# EAGLE design Rs485 current sense V1.1 (EAGLE 7.2.0)
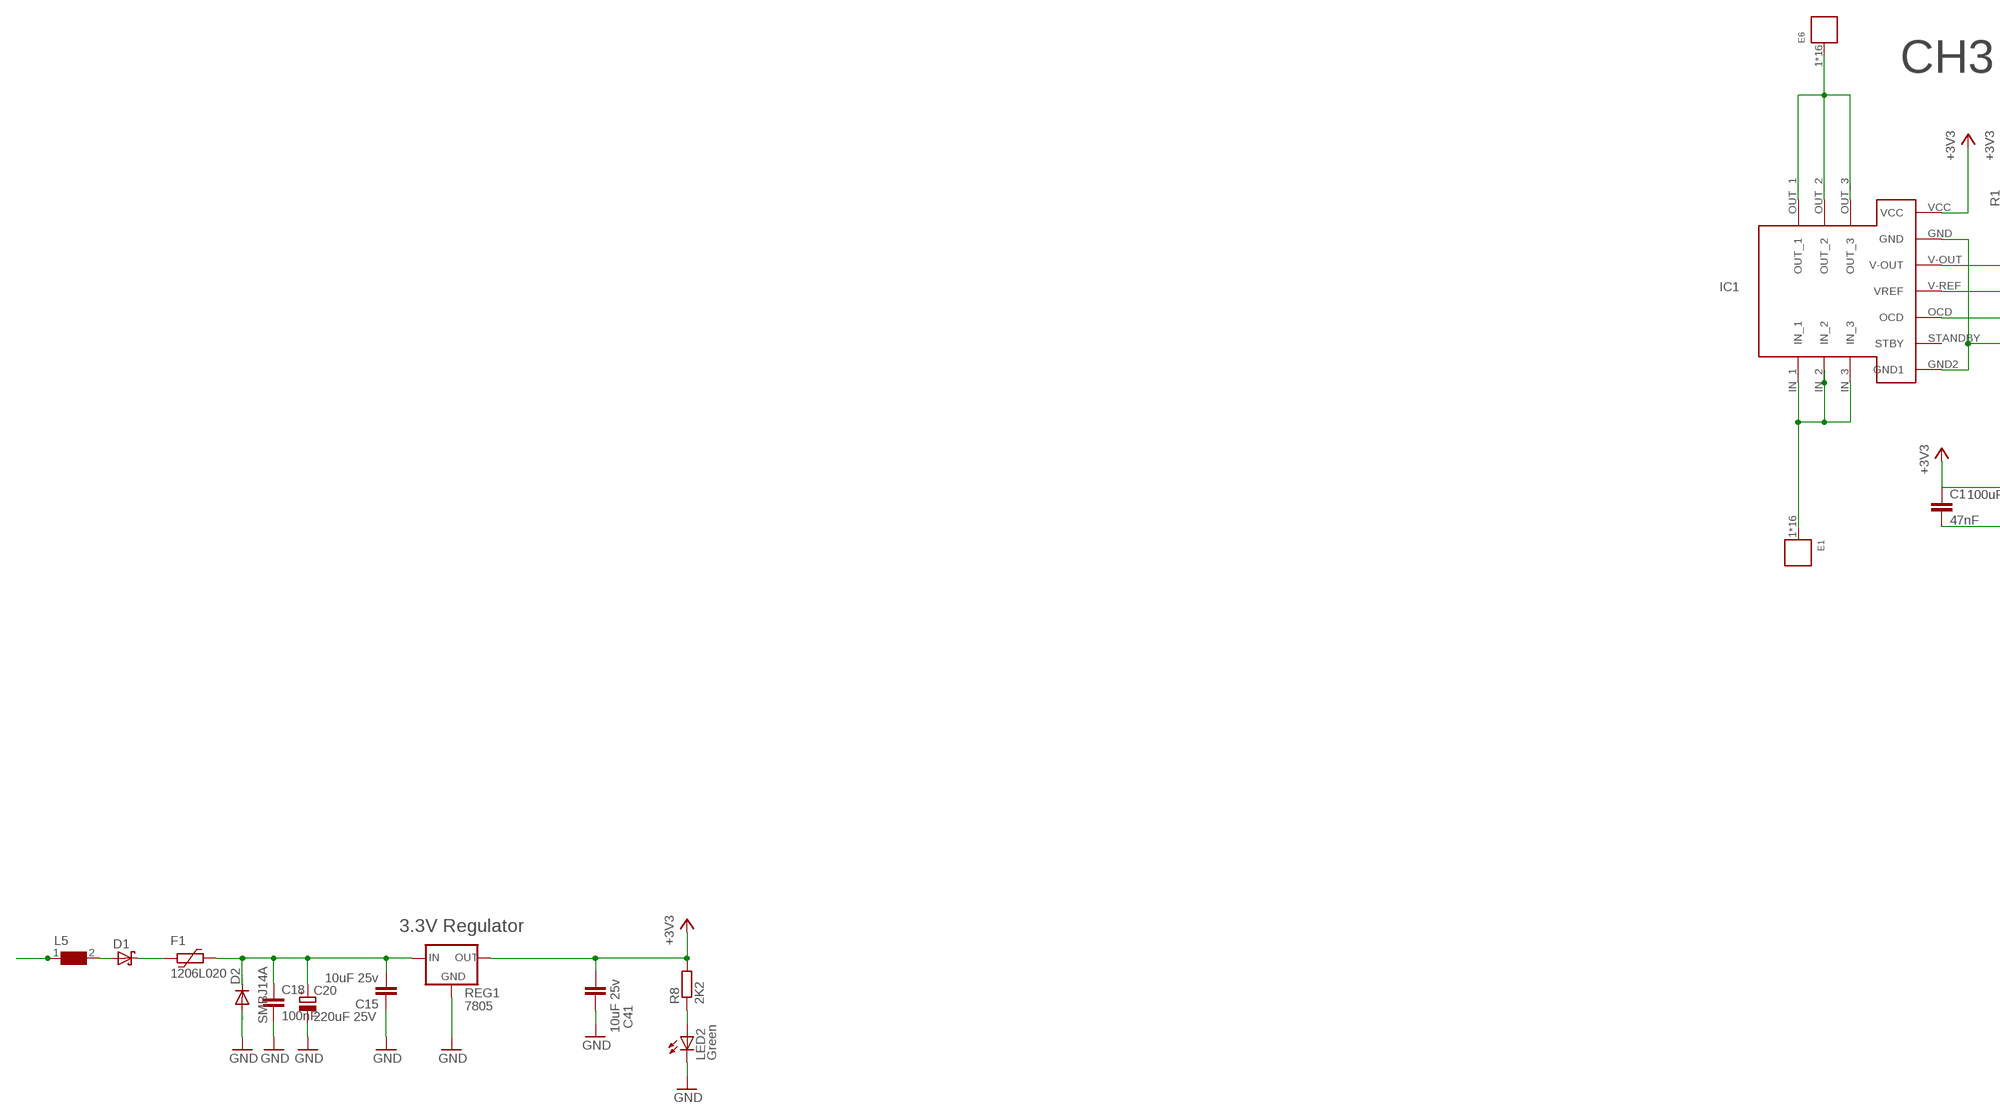
[diagram p0: schematic, sheet 1, part 1 of 3]
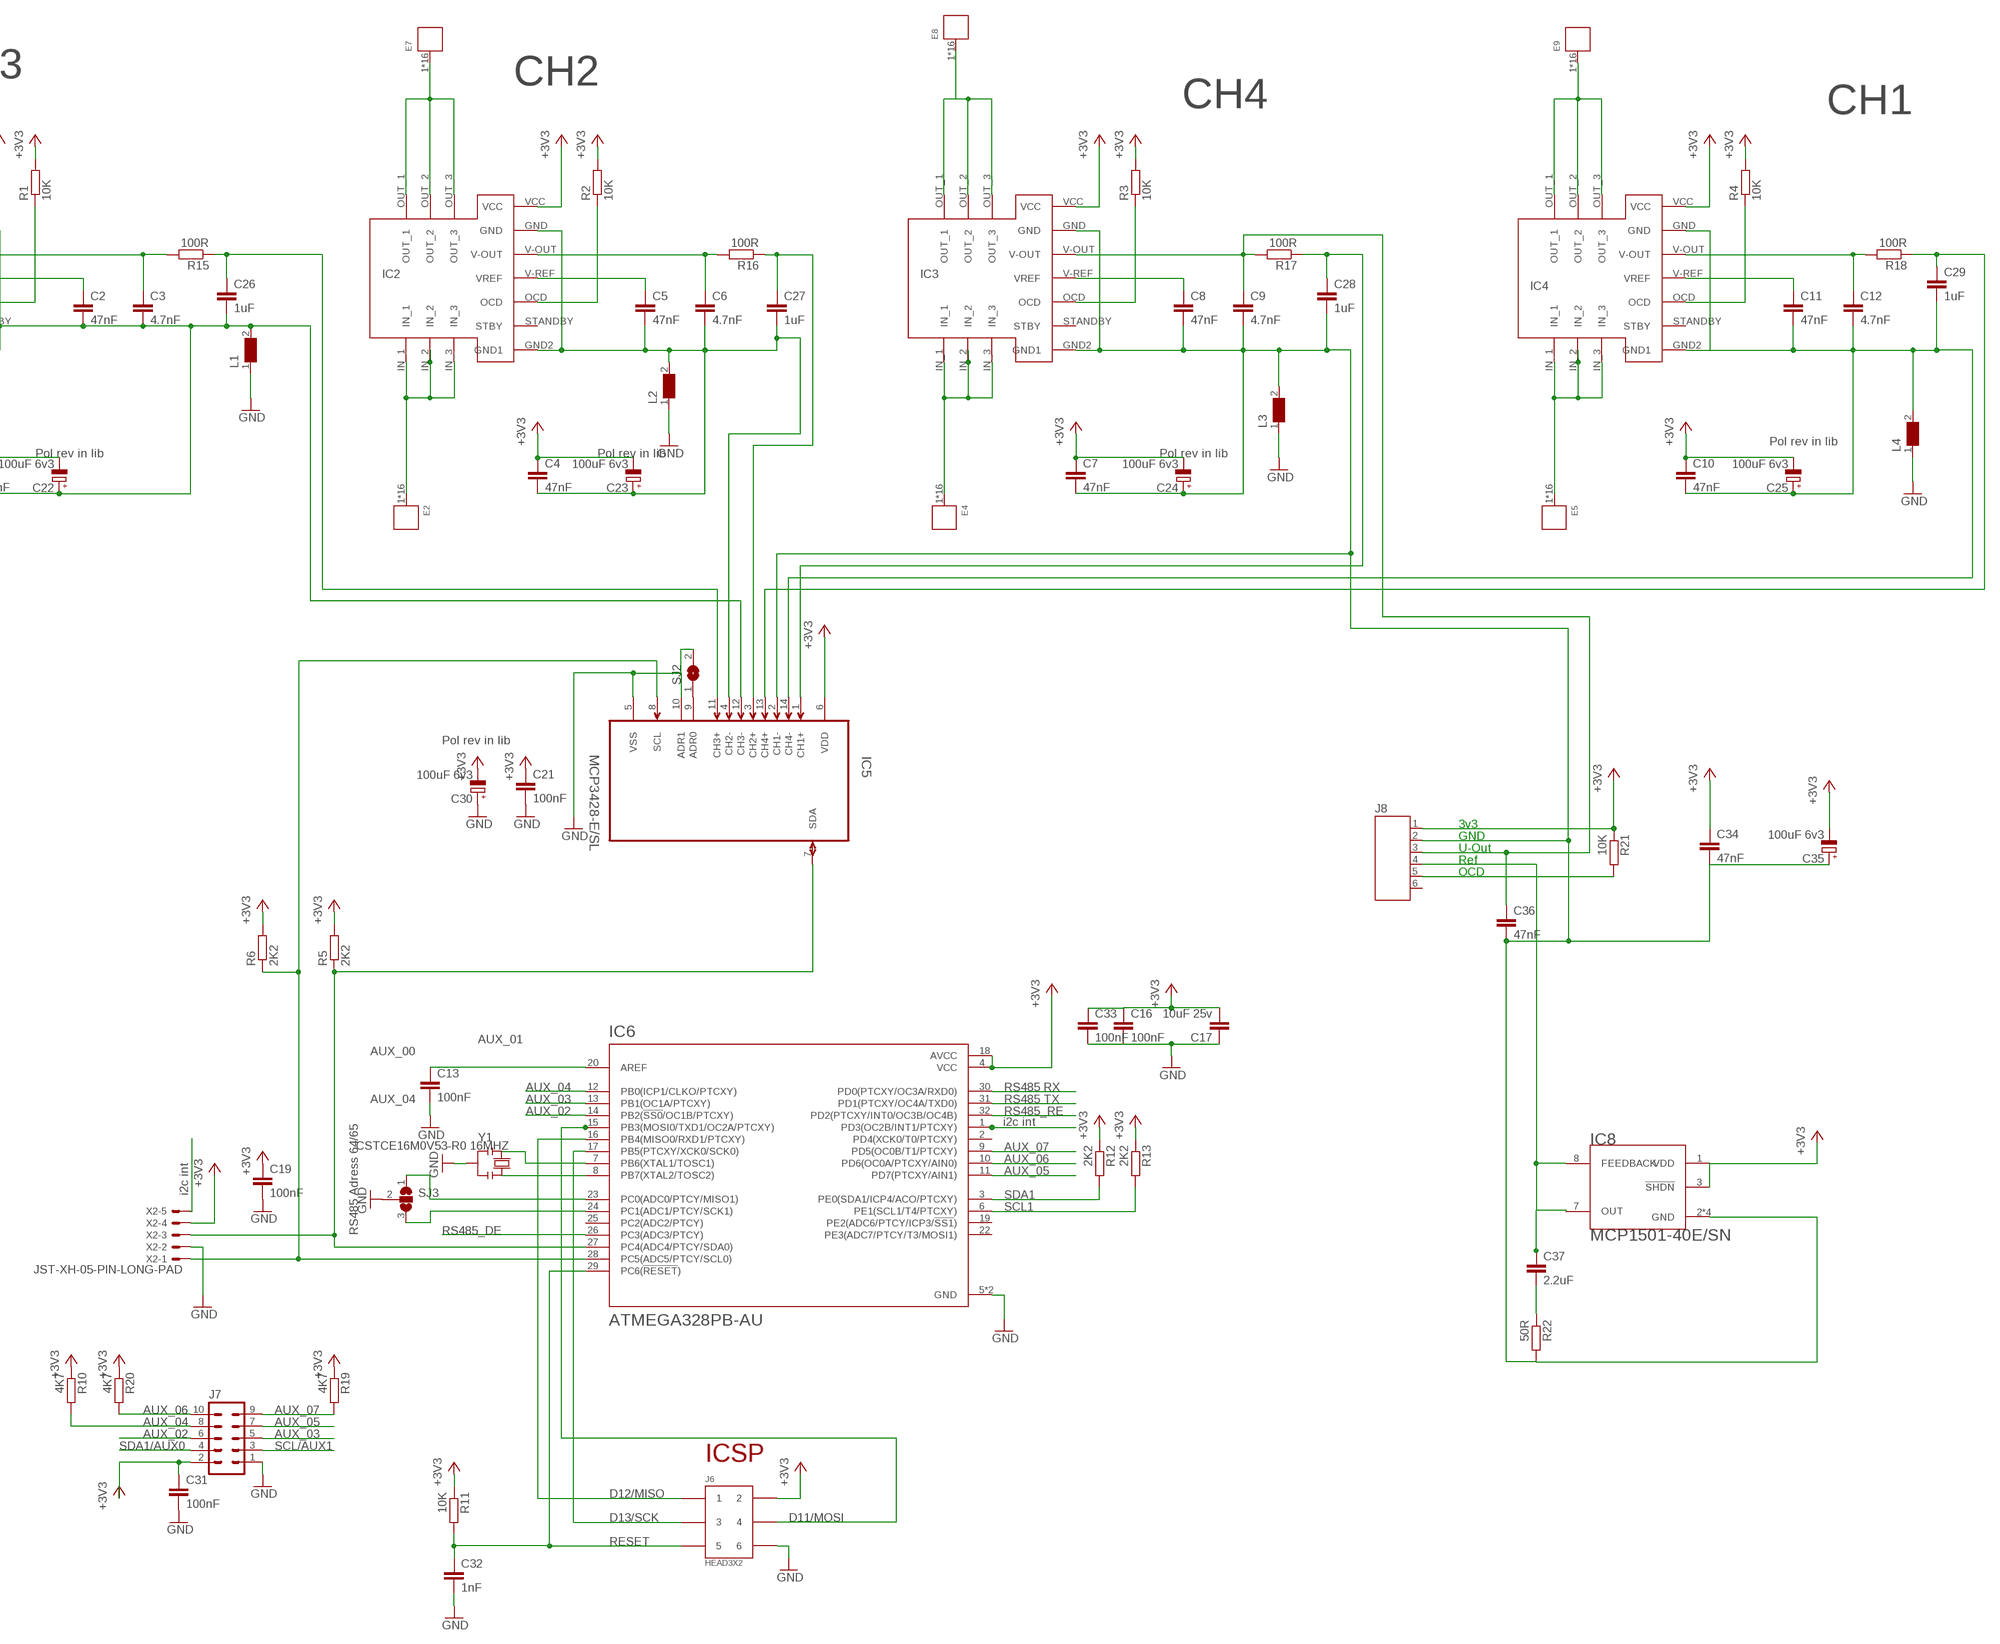
[diagram p1: schematic, sheet 1, part 2 of 3]
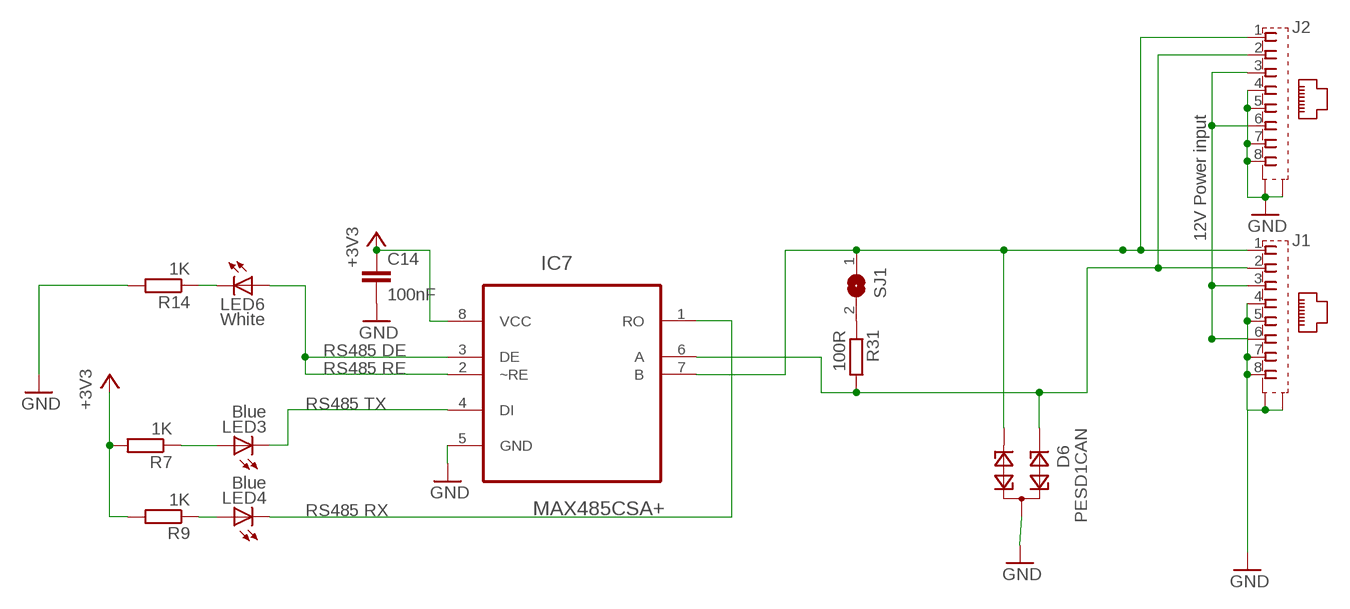
[diagram p2: schematic, sheet 1, part 3 of 3]

## Parts
C1  47nF  C-EUC0603  [C0603]
C2  47nF  C-EUC0603  [C0603]
C3  4.7nF  C-EUC0603  [C0603]
C4  47nF  C-EUC0603  [C0603]
C5  47nF  C-EUC0603  [C0603]
C6  4.7nF  C-EUC0603  [C0603]
C7  47nF  C-EUC0603  [C0603]
C8  47nF  C-EUC0603  [C0603]
C9  4.7nF  C-EUC0603  [C0603]
C10  47nF  C-EUC0603  [C0603]
C11  47nF  C-EUC0603  [C0603]
C12  4.7nF  C-EUC0603  [C0603]
C13  100nF  C-EUC0603  [C0603]
C14  100nF  C-EUC0603  [C0603]
C15  10uF 25v  C-EUC1206  [C1206]
C16  100nF  C-EUC0603  [C0603]
C17  10uF 25v  C-EUC1206  [C1206]
C18  100nF  C-EUC0603  [C0603]
C19  100nF  C-EUC0603  [C0603]
C20  220uF 25V  CPOL-EUF  [PANASONIC_F]
C21  100nF  C-EUC0603  [C0603]
C22  100uF 6v3  CPOL-EUCT3528  [CT3528]
C23  100uF 6v3  CPOL-EUCT3528  [CT3528]
C24  100uF 6v3  CPOL-EUCT3528  [CT3528]
C25  100uF 6v3  CPOL-EUCT3528  [CT3528]
C26  1uF  C-EUC0603  [C0603]
C27  1uF  C-EUC0603  [C0603]
C28  1uF  C-EUC0603  [C0603]
C29  1uF  C-EUC0603  [C0603]
C30  100uF 6v3  CPOL-EUCT3528  [CT3528]
C31  100nF  C-EUC0603  [C0603]
C32  1nF  C-EUC0603  [C0603]
C33  100nF  C-EUC0603  [C0603]
C34  47nF  C-EUC0603  [C0603]
C35  100uF 6v3  CPOL-EUCT3528  [CT3528]
C36  47nF  C-EUC0603  [C0603]
C37  2.2uF  C-EUC0805  [C0805]
C41  10uF 25v  C-EUC1206  [C1206]
D1  SCHOTTKY-DIODESMD  [SMB]
D2  SMBJ14A  DIODE-DO214AC  [DO214AC]
D6  PESD1CAN  [SOT23]
E1  WP-BUFU_J(10)  [16PINS_10X10_FULL]
E2  WP-BUFU_J(10)  [16PINS_10X10_FULL]
E4  WP-BUFU_J(10)  [16PINS_10X10_FULL]
E5  WP-BUFU_J(10)  [16PINS_10X10_FULL]
E6  WP-BUFU_J(10)  [16PINS_10X10_FULL]
E7  WP-BUFU_J(10)  [16PINS_10X10_FULL]
E8  WP-BUFU_J(10)  [16PINS_10X10_FULL]
E9  WP-BUFU_J(10)  [16PINS_10X10_FULL]
F1  1206L020  [1206L]
IC1  HO15-NP/SP33-1000  [HO15-NP/SP33-1000]
IC2  HO15-NP/SP33-1000  [HO15-NP/SP33-1000]
IC3  HO15-NP/SP33-1000  [HO15-NP/SP33-1000]
IC4  HO15-NP/SP33-1000  [HO15-NP/SP33-1000]
IC5  MCP3428-E/SL  [SOIC127P600X175-14N]
IC6  ATMEGA328PB-AU  [QFP80P900X900X120-32N]
IC7  MAX485CSA+  [SOIC127P600X175-8N]
IC8  MCP1501-40E/SN  [SOIC127P600X175-8N]
J1  555153-1  [555153-1]
J2  555153-1  [555153-1]
J6  HEAD3X2  [HEAD3X2]
J7  MA05-2  [MA05-2]
J8  JST-PH6  [JST-PH6]
L1  WE-CBF-74279209_0805  [0805]
L2  WE-CBF-74279209_0805  [0805]
L3  WE-CBF-74279209_0805  [0805]
L4  WE-CBF-74279209_0805  [0805]
L5  WE-CBF-7427922_1206  [1206]
LED2  Green  LEDCHIPLED_0805  [CHIPLED_0805]
LED3  Blue  LEDCHIPLED_0805  [CHIPLED_0805]
LED4  Blue  LEDCHIPLED_0805  [CHIPLED_0805]
LED6  White  LEDCHIPLED_0805  [CHIPLED_0805]
R1  10K  R-EU_R0603  [R0603]
R2  10K  R-EU_R0603  [R0603]
R3  10K  R-EU_R0603  [R0603]
R4  10K  R-EU_R0603  [R0603]
R5  2K2  R-EU_R0603  [R0603]
R6  2K2  R-EU_R0603  [R0603]
R7  1K  R-EU_R0805  [R0805]
R8  2K2  R-EU_R0805  [R0805]
R9  1K  R-EU_R0805  [R0805]
R10  4K7  R-EU_R0603  [R0603]
R11  10K  R-EU_R0603  [R0603]
R12  2K2  R-EU_R0603  [R0603]
R13  2K2  R-EU_R0603  [R0603]
R14  1K  R-EU_R0805  [R0805]
R15  100R  R-EU_R0603  [R0603]
R16  100R  R-EU_R0603  [R0603]
R17  100R  R-EU_R0603  [R0603]
R18  100R  R-EU_R0603  [R0603]
R19  4K7  R-EU_R0603  [R0603]
R20  4K7  R-EU_R0603  [R0603]
R21  10K  R-EU_R0603  [R0603]
R22  50R  R-EU_R0603  [R0603]
R31  100R  R-EU_R0805  [R0805]
REG1  7805  78XXS  [78XXS]
SJ1  SJ  [SJ]
SJ2  SJ  [SJ]
SJ3  SJ2W  [SJ_2]
X2  JST-XH-05-PIN-LONG-PAD  [JST-XH-05-PACKAGE-LONG-PAD]
Y1  CSTCE16M0V53-R0 16MHZ  RESONATORMU  [RESONATOR]

## Nets
1_IN: E5.1 E5.2 E5.3 E5.4 E5.5 E5.6 E5.7 E5.8 E5.9 E5.10 E5.11 E5.12 E5.13 E5.14 E5.15 E5.16 IC4.IN_1 IC4.IN_2 IC4.IN_3
1_OUT: E9.1 E9.2 E9.3 E9.4 E9.5 E9.6 E9.7 E9.8 E9.9 E9.10 E9.11 E9.12 E9.13 E9.14 E9.15 E9.16 IC4.OUT_1 IC4.OUT_2 IC4.OUT_3
1GNDA [power]: C10.2 C11.2 C12.2 C25.-(+) C29.2 IC4.GND IC4.GND2(GND1) IC5.14(CH4-) L4.2
2_IN: E2.1 E2.2 E2.3 E2.4 E2.5 E2.6 E2.7 E2.8 E2.9 E2.10 E2.11 E2.12 E2.13 E2.14 E2.15 E2.16 IC2.IN_1 IC2.IN_2 IC2.IN_3
2_OUT: E7.1 E7.2 E7.3 E7.4 E7.5 E7.6 E7.7 E7.8 E7.9 E7.10 E7.11 E7.12 E7.13 E7.14 E7.15 E7.16 IC2.OUT_1 IC2.OUT_2 IC2.OUT_3
2GND [power]: C4.2 C5.2 C6.2 C23.-(+) C27.2 IC2.GND IC2.GND2(GND1) IC5.4(CH2-) L2.2
3_IN: E1.1 E1.2 E1.3 E1.4 E1.5 E1.6 E1.7 E1.8 E1.9 E1.10 E1.11 E1.12 E1.13 E1.14 E1.15 E1.16 IC1.IN_1 IC1.IN_2 IC1.IN_3
3_OUT: E6.1 E6.2 E6.3 E6.4 E6.5 E6.6 E6.7 E6.8 E6.9 E6.10 E6.11 E6.12 E6.13 E6.14 E6.15 E6.16 IC1.OUT_1 IC1.OUT_2 IC1.OUT_3
3GND [power]: C1.2 C2.2 C3.2 C22.-(+) C26.2 IC1.GND IC1.GND2(GND1) IC5.12(CH3-) L1.2
4_IN: E4.1 E4.2 E4.3 E4.4 E4.5 E4.6 E4.7 E4.8 E4.9 E4.10 E4.11 E4.12 E4.13 E4.14 E4.15 E4.16 IC3.IN_1 IC3.IN_2 IC3.IN_3
4_OUT: E8.1 E8.2 E8.3 E8.4 E8.5 E8.6 E8.7 E8.8 E8.9 E8.10 E8.11 E8.12 E8.13 E8.14 E8.15 E8.16 IC3.OUT_1 IC3.OUT_2 IC3.OUT_3
4GNDA [power]: C7.2 C8.2 C9.2 C24.-(+) C28.2 C34.2 C35.-(+) C36.2 IC3.GND IC3.GND2(GND1) IC5.2(CH1-) IC8.2(GND) IC8.4(GND) IC8.5(GND) IC8.6(GND) J8.2 L3.2 R22.2
12V [power]: J1.3 J1.6 J2.3 J2.6 L5.1
+3V3 [power]: C1.1 C4.1 C7.1 C10.1 C14.1 C16.1 C17.2 C19.1 C21.1 C22.+(-) C23.+(-) C24.+(-) C25.+(-) C30.+(-) C31.1 C33.1 C34.1 C35.+(-) C41.2 IC1.VCC IC2.VCC IC3.VCC IC4.VCC IC5.6(VDD) IC6.4(VCC) IC6.18(AVCC) IC7.8(VCC) IC8.1(VDD) IC8.3(!SHDN) J6.2 J7.2 J8.1 R1.2 R2.2 R3.2 R4.2 R5.2 R6.2 R7.2 R8.2 R9.2 R10.1 R11.1 R12.1 R13.1 R19.1 R20.1 R21.1 REG1.OUT X2.4
ATMEGA-AREF: C13.1 IC6.20(AREF)
AUX_02: IC6.14(PB2(!SS0!/OC1B/PTCXY)) J7.6
AUX_03: IC6.13(PB1(OC1A/PTCXY)) J7.5
AUX_04: IC6.12(PB0(ICP1/CLKO/PTCXY)) J7.8 R10.2
AUX_05: IC6.11(PD7(PTCXY/AIN1)) J7.7
AUX_06: IC6.10(PD6(OC0A/PTCXY/AIN0)) J7.10 R20.2
AUX_07: IC6.9(PD5(OC0B/T1/PTCXY)) J7.9 R19.2
CH1-OUTA: C29.1 IC5.13(CH4+) R18.1
CH2-OUT: C27.1 IC5.3(CH2+) R16.1
CH3-OUT: C26.1 IC5.11(CH3+) R15.1
CH4-OUTA: C28.1 IC5.1(CH1+) R17.1
D11/MOSI: IC6.15(PB3(MOSI0/TXD1/OC2A/PTCXY)) J6.4
D12/MISO: IC6.16(PB4(MISO0/RXD1/PTCXY)) J6.1
D13/SCK: IC6.17(PB5(PTCXY/XCK0/SCK0)) J6.3
GND [power]: C13.2 C14.2 C15.1 C16.2 C17.1 C18.2 C19.2 C20.- C21.2 C30.-(+) C31.2 C32.2 C33.2 C41.1 D2.A D6.3 IC5.5(VSS) IC5.10(ADR1) IC6.5(GND) IC6.21(GND) IC7.5(GND) J1.4 J1.5 J1.7 J1.8 J1.G1(S1) J1.G2(S2) J2.4 J2.5 J2.7 J2.8 J2.G1(S1) J2.G2(S2) J6.6 J7.1 L1.1 L2.1 L3.1 L4.1 LED2.C R14.2 REG1.GND SJ2.2 SJ3.2 X2.2 Y1.2
I2C_INT: IC6.1(PD3(OC2B/INT1/PTCXY)) X2.5
I2C_SCL: IC5.8(SCL) IC6.28(PC5(ADC5/PTCY/SCL0)) R6.1 X2.1
I2C_SDA: IC5.7(SDA) IC6.27(PC4(ADC4/PTCY/SDA0)) R5.1 X2.3
N$1: IC6.23(PC0(ADC0/PTCY/MISO1)) SJ3.1
N$2: IC1.OCD R1.1
N$3: IC6.24(PC1(ADC1/PTCY/SCK1)) SJ3.3
N$4: C2.1 IC1.V-REF(VREF)
N$5: J8.5 R21.2
N$6: C9.1 C36.1 IC3.V-OUT J8.3 R17.2
N$7: C37.1 IC8.7(OUT) IC8.8(FEEDBACK) J8.4
N$8: IC2.OCD R2.1
N$9: C5.1 IC2.V-REF(VREF)
N$10: C6.1 IC2.V-OUT R16.2
N$11: C37.2 R22.1
N$12 [power]: D1.A L5.2
N$13: IC3.OCD R3.1
N$14: C8.1 IC3.V-REF(VREF)
N$18: IC4.OCD R4.1
N$19: C11.1 IC4.V-REF(VREF)
N$23: IC6.8(PB7(XTAL2/TOSC2)) Y1.3
N$25: LED2.A R8.1
N$27 [power]: D1.C F1.2
N$34: LED3.A R7.1
N$35: LED4.A R9.1
N$36: LED6.C R14.1
N$38: IC5.9(ADR0) SJ2.1
N$39: C3.1 IC1.V-OUT R15.2
N$42: C12.1 IC4.V-OUT R18.2
N$60: R31.1 SJ1.2
RESET: C32.1 IC6.29(PC6(!RESET!)) J6.5 R11.2
RS485_DE: IC6.26(PC3(ADC3/PTCY)) IC7.2(~RE) IC7.3(DE) LED6.A
RS485_N [Rs485 Pair]: D6.1 IC7.6(A) J1.2 J2.2 R31.2
RS485_P: D6.2 IC7.7(B) J1.1 J2.1 SJ1.1
RS485_RE: IC6.32(PD2(PTCXY/INT0/OC3B/OC4B))
RS485_RX: IC6.30(PD0(PTCXY/OC3A/RXD0)) IC7.1(RO) LED4.C
RS485_TX: IC6.31(PD1(PTCXY/OC4A/TXD0)) IC7.4(DI) LED3.C
SCL1: IC6.6(PE1(SCL1/T4/PTCXY)) J7.3 R13.2
SDA1: IC6.3(PE0(SDA1/ICP4/ACO/PTCXY)) J7.4 R12.2
VBAT12V [power]: C15.2 C18.1 C20.+ D2.C F1.1 REG1.IN
XTAL2: IC6.7(PB6(XTAL1/TOSC1)) Y1.1
Unconnected: IC1.STANDBY(STBY) IC2.STANDBY(STBY) IC3.STANDBY(STBY) IC4.STANDBY(STBY) IC6.2(PD4(XCK0/T0/PTCXY)) IC6.19(PE2(ADC6/PTCY/ICP3/!SS1!)) IC6.22(PE3(ADC7/PTCY/T3/MOSI1)) IC6.25(PC2(ADC2/PTCY)) J8.6

## Notes on the sheet
- CH3 | CH2
- CH4 | CH1
- IC1 | IC2 | IC3
- IC4
- Pol rev in lib
- Pol rev in lib | Pol rev in lib | Pol rev in lib
- Pol rev in lib
- 3v3
- GND
- U-Out
- 3.3V Regulator | Ref
- OCD
- AUX_01
- AUX_00
- AUX_04 | RS485 RX
- AUX_04 | AUX_03 | RS485 TX
- AUX_02 | RS485_RE
- i2c int
- AUX_07
- AUX_06
- AUX_05
- i2c int
- SDA1
- SCL1
- RS485 Adress 64/65 | RS485_DE
- AUX_06 | AUX_07
- AUX_04 | AUX_05
- AUX_02 | AUX_03
- SDA1/AUX0 | SCL/AUX1
- ICSP
- 12V Power input
- RS485 DE
- RS485 RE
- RS485 TX
- RS485 RX

## Library data of the parts
C1-C13 C16 C18 C19 C21 C26-C29 C31-C34 C36 = rcl:C-EU: CAPACITOR, European symbol
C14 C15 C17 C37 C41 = resistor:C-EU: CAPACITOR, European symbol
C20 = rcl:CPOL-EU: POLARIZED CAPACITOR, European symbol
C22-C25 C30 C35 = resistor:CPOL-EU: POLARIZED CAPACITOR, European symbol
D1 = diode:SCHOTTKY-DIODE: Schottky Diode
D2 = diode:DIODE-: DIODE
D6 = diode:PESD1CAN: CAN bus ESD protection diode Source: http://www.nxp.com/documents/data_sheet/PESD1CAN.pdf
E1 E2 E4-E9 = Wurth_Elektronik_Electromechanic_Power_Elements_rev15c:WP-BUFU: Bush with full plain Pin-Plate Characteristics Drill hole diameter:1.60(-0.03)mm Final hole diameter for HAL surface:1.45(+/-0.05)mm forchemical tin:1.475(+/-0.05)mm Min. layer thickness of copper in the via:25UM Max.layer thickness of tin in the via:15UM MATERIAL:CuZn39Pb3 Variant abbreviation FULL means Bush with full plain Pin-Plate J,K,L,G,I means Format Type 10X10,9X9,5X5 means Dimensions of Procucts J(10) means format type is J ,Dimension of product is 10mm. J(9)means format type is J ,Dimension of product is 9mm. HAL means Land pattern for HAL <http://katalog.we-online.de/media/images/v2/Family_WP-BUFU.jpg> Details see: http://katalog.we-online.de/en/em/Powerbuchsen_vollflaechig/7462810?m 2015 (C) Wurth Elektronik
F1 = polyfuse-smd_10:?: Polyfuse Resettable PTC Source: http://www.littelfuse.com/products/resettable-ptcs.aspx; MF: Littelfuse; MPN: 1206L020; OC_FARNELL: 2072173; OC_NEWARK: 05M2300
IC1-IC4 = lem:HO15-NP/SP33-1000: Current Transducer, HO-NP Series, PCB, 15A, -37.5A to 37.5A, 1 %, Voltage Output, 3.3 Vd Farnell: 2664206
IC5 = Microchip_By_element14_Batch_1:MCP3428-E/SL: Analog-to-Digital Converter; MPN: MCP3428-E/SL; OC_FARNELL: 1825014; OC_NEWARK: 52R9962; PACKAGE: SOIC-14; SUPPLIER: Microchip
IC6 = ATMEGA328PB-AU:ATMEGA328PB-AU: ATmega Series 20 MHz 32 KB Flash 2 KB SRAM 8-Bit Microcontroller - TQFP-32; AVAILABILITY: Unavailable; DESCRIPTION: AVR microcontroller; EEPROM: 1024B; SRAM: 2kB; Flash: 32kB; TQFP32; MF: Microchip; MP: ATMEGA328PB-AU; PACKAGE: TQFP-32 Microchip; PRICE: None
IC7 = Maxim_By_element14_Batch_1:MAX485CSA+: ±15kV ESD-Protected, Slew-Rate-Limited, Low-Power, RS-485/RS-422 Transceivers; MPN: MAX485CSA+; OC_FARNELL: 9725954; OC_NEWARK: 68K4795; PACKAGE: SOIC-8; SUPPLIER: Maxim
IC8 = MCP1501-40E_SN:MCP1501-40E/SN: High Precision Buffered Voltage Reference; AVAILABILITY: Unavailable; DESCRIPTION: High Precision Buffered Voltage Reference; MF: Microchip; MP: MCP1501-40E/SN; PACKAGE: SOIC-8 Microchip; PRICE: None
J1 J2 = con-amp:555153-1: AMP connector
J6 = MyCON2:HEAD3X2
J7 = con-lstb:MA05-2: PIN HEADER; OC_FARNELL: unknown; OC_NEWARK: unknown
J8 = jst-ph:JST-PH6
L1-L4 = WE-CBF:WE-CBF: SMD EMI Suppression Ferrite Beads WE-CBF - Excellent anti-EMI properties - Low DC-restistance - Impedances till 3000 ohms - Rated current up to 6 A -- Reliable Ni-Sn electrodes -- Perfect as data lined filter and for uncoupling of distribution voltage; MPN: 74279209; OC_FARNELL: 1635722; OC_NEWARK: 08P2381; PACKAGE: IND-0805; SUPPLIER: Wuerth Elektronik
L5 = WE-CBF:WE-CBF: SMD EMI Suppression Ferrite Beads WE-CBF - Excellent anti-EMI properties - Low DC-restistance - Impedances till 3000 ohms - Rated current up to 6 A -- Reliable Ni-Sn electrodes -- Perfect as data lined filter and for uncoupling of distribution voltage; MPN: 7427922; OC_FARNELL: 1635740; OC_NEWARK: 08P2405; PACKAGE: IND-1206; SUPPLIER: Wuerth Elektronik
LED2-LED4 LED6 = led:LED: LED OSRAM: - CHIPLED LG R971, LG N971, LY N971, LG Q971, LY Q971, LO R971, LY R971 LH N974, LH R974 LS Q976, LO Q976, LY Q976 LO Q996 - Hyper CHIPLED LW Q18S LB Q993, LB Q99A, LB R99A - SideLED LS A670, LO A670, LY A670, LG A670, LP A670 LB A673, LV A673, LT A673, LW A673 LH A674 LY A675 LS A676, LA A676, LO A676, LY A676, LW A676 LS A679, LY A679, LG A679 - Hyper Micro SIDELED® LS Y876, LA Y876, LO Y876, LY Y876 LT Y87S - SmartLED LW L88C, LW L88S LB L89C, LB L89S, LG L890 LS L89K, LO L89K, LY L89K LS L896, LA L896, LO L896, LY L896 - TOPLED LS T670, LO T670, LY T670, LG T670, LP T670 LSG T670, LSP T670, LSY T670, LOP T670, LYG T670 LG T671, LOG T671, LSG T671 LB T673, LV T673, LT T673, LW T673 LH T674 LS T676, LA T676, LO T676, LY T676, LB T676, LH T676, LSB T676, LW T676 LB T67C, LV T67C, LT T67C, LS T67K, LO T67K, LY T67K, LW E67C LS E67B, LA E67B, LO E67B, LY E67B, LB E67C, LV E67C, LT E67C LW T67C LS T679, LY T679, LG T679 LS T770, LO T770, LY T770, LG T770, LP T770 LB T773, LV T773, LT T773, LW T773 LH T774 LS E675, LA E675, LY E675, LS T675 LS T776, LA T776, LO T776, LY T776, LB T776 LHGB T686 LT T68C, LB T68C - Hyper Mini TOPLED® LB M676 - Mini TOPLED Santana® LG M470 LS M47K, LO M47K, LY M47K Source: http://www.osram.convergy.de LUXEON: - LUMILED® LXK2-PW12-R00, LXK2-PW12-S00, LXK2-PW14-U00, LXK2-PW14-V00 LXK2-PM12-R00, LXK2-PM12-S00, LXK2-PM14-U00 LXK2-PE12-Q00, LXK2-PE12-R00, LXK2-PE12-S00, LXK2-PE14-T00, LXK2-PE14-U00 LXK2-PB12-K00, LXK2-PB12-L00, LXK2-PB12-M00, LXK2-PB14-N00, LXK2-PB14-P00, LXK2-PB14-Q00 LXK2-PR12-L00, LXK2-PR12-M00, LXK2-PR14-Q00, LXK2-PR14-R00 LXK2-PD12-Q00, LXK2-PD12-R00, LXK2-PD12-S00 LXK2-PH12-R00, LXK2-PH12-S00 LXK2-PL12-P00, LXK2-PL12-Q00, LXK2-PL12-R00 Source: www.luxeon.com KINGBRIGHT: KA-3528ASYC Source: www.kingbright.com
R1-R6 R15-R18 = rcl:R-EU_: RESISTOR, European symbol
R7-R14 R19-R22 R31 = resistor:R-EU_: RESISTOR, European symbol
REG1 = v-reg:78XXS: VOLTAGE REGULATOR
SJ1 SJ2 = jumper:SJ: SMD solder JUMPER
SJ3 = jumper:SJ2W: SMD solder JUMPER
X2 = JST XH Connectors v1-0:JST-XH-05-PIN: JST XH Connector 2 Pin Wire to board connector. Pitch: 2,54 mm, (0.100") Number of pins: 5 Created by Rembrandt Electronics www.rembrandtelectronics.com
Y1 = SmartPrj:RESONATOR

## Net classes
1 power: width 0.152 mm, drill 0.61 mm, clearance 0.152 mm
2 Rs485 Pair: width 0.025 mm, drill 0.127 mm, clearance 0.076 mm

## Board
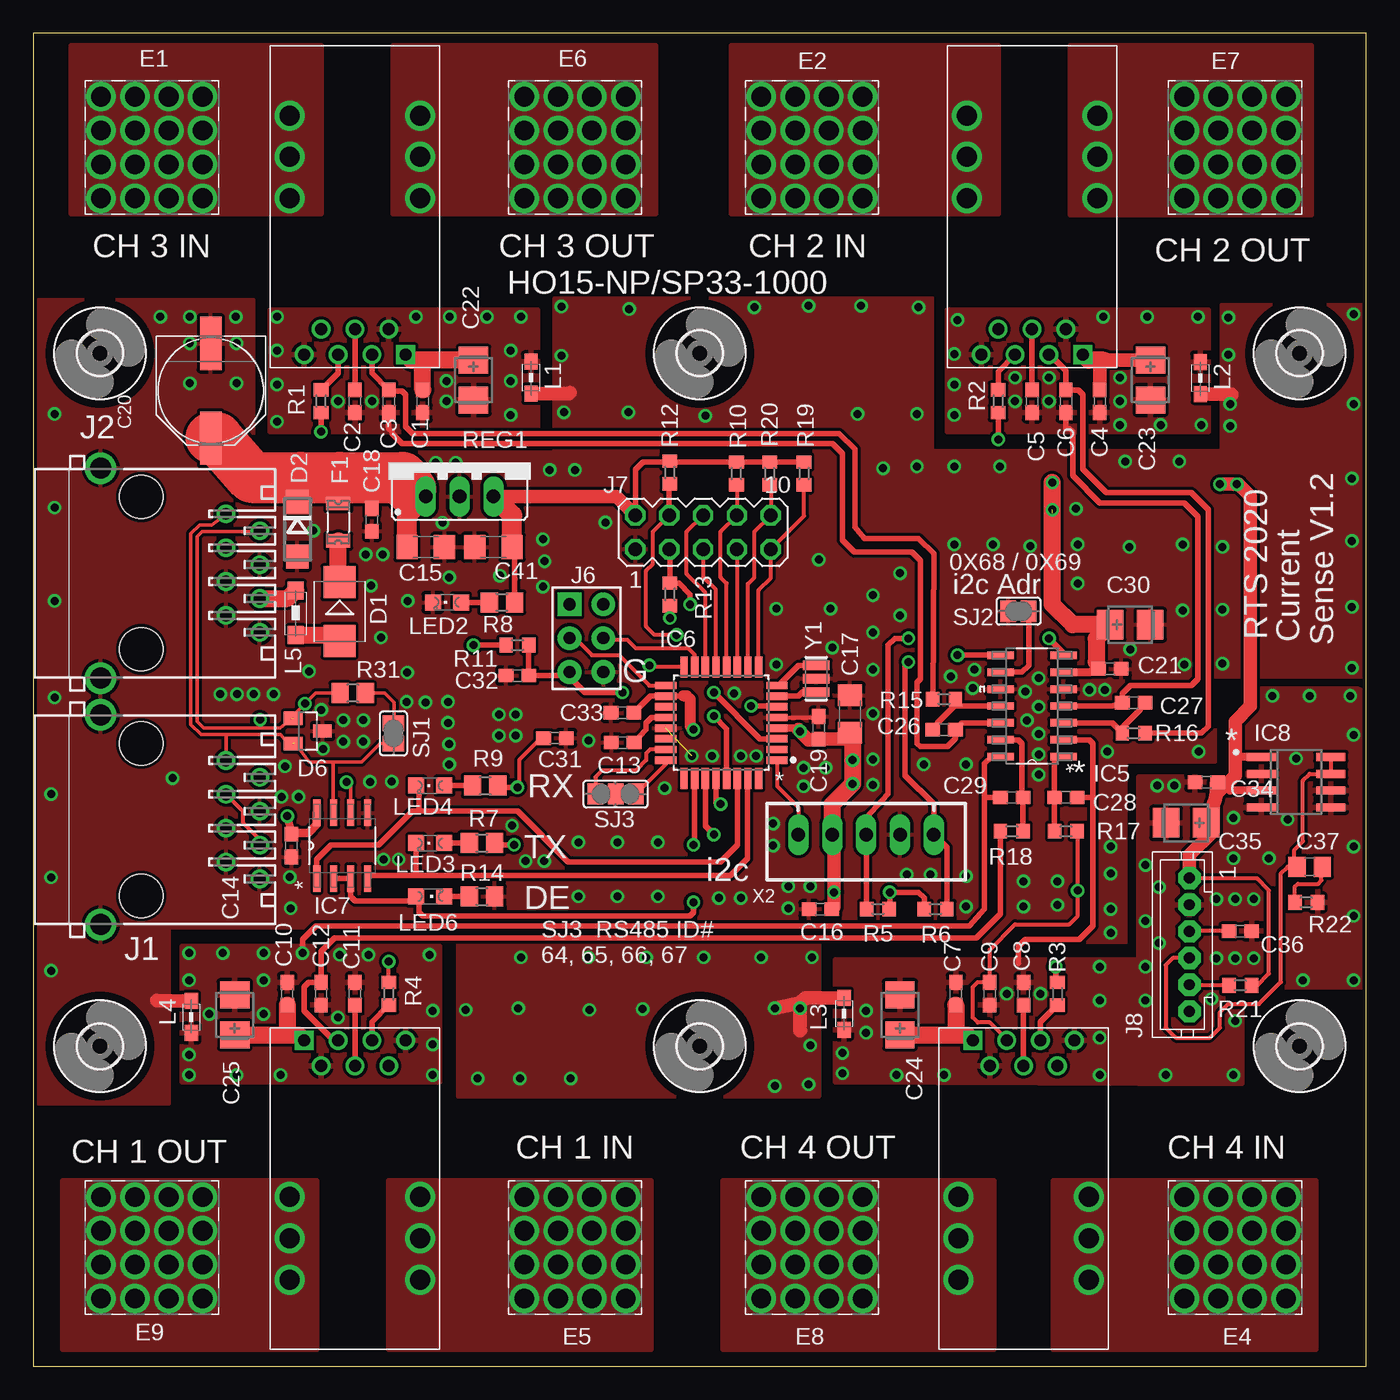
[diagram p3: board, top side]
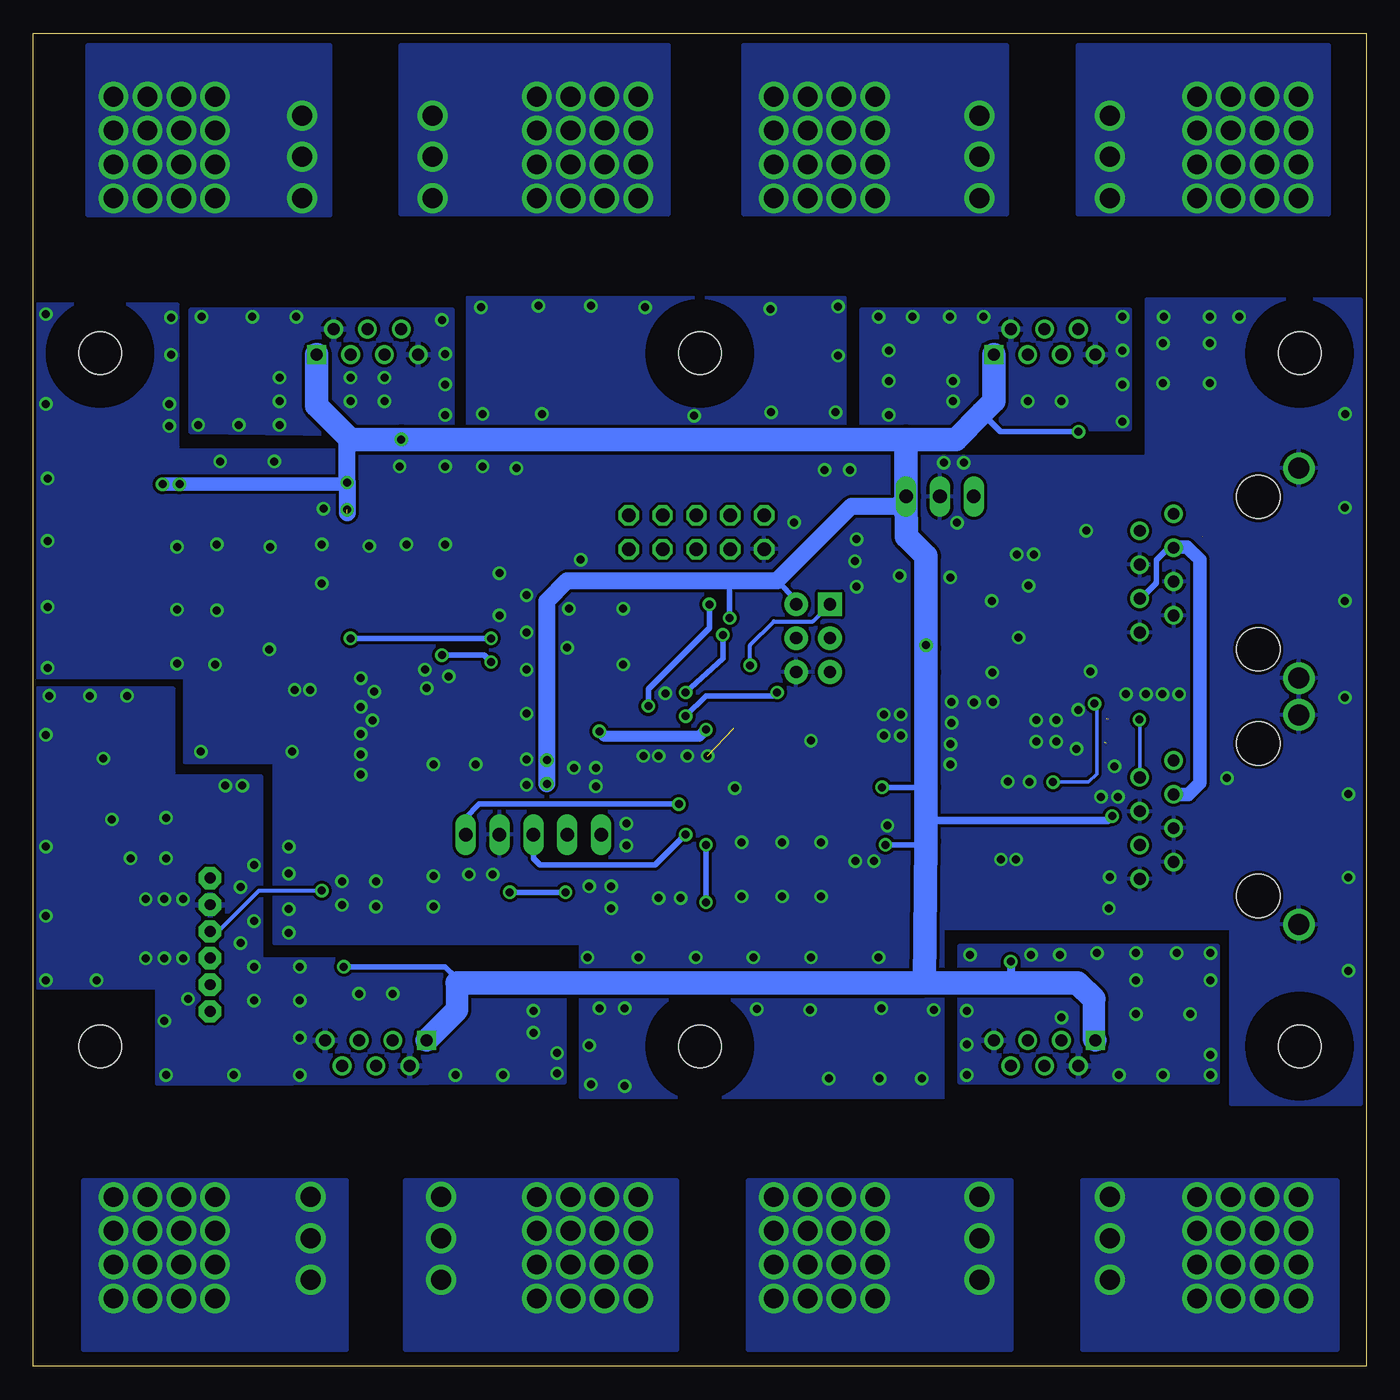
[diagram p4: board, bottom side, seen from below]

Size 100 x 100 mm. Coordinates in mm from the lower left corner, seen from the top.
Outline: 0,0 100,0 100,100 0,100 0,0
Copper layers (1*16): Top 0.035mm / dielectric 1.5mm / Bottom 0.035mm
Design rules "default *": minimum track width 10mil, minimum drill 12mil, track to track 9mil, track to pad 9mil, pad to pad 9mil, via to via 9mil, smd to smd 9mil, copper to edge 10mil, drill to drill 8mil, minimum pad ring 10mil, minimum via ring 8mil, stop-mask expansion 4mil, vias tented up to drill 0mil, thermal gap 10mil

### Footprints (pad centres in the part's own frame; a part is rotated, then mirrored left to right if it is on the bottom)
C0603 = smd 1.1 x 1: 1 -0.85,0; 2 0.85,0
C1206 = smd 1.6 x 1.8: 1 -1.4,0; 2 1.4,0
PANASONIC_F = smd 4 x 1.6: + 3.55,0; - -3.55,0
CT3528 = smd 2 x 2.2: + -1.5,0; - 1.5,0
C0805 = smd 1.3 x 1.5: 1 -0.95,0; 2 0.95,0
SMB = smd 2.4 x 2.4: A 2.2,0; C -2.2,0
DO214AC = smd 1.8 x 1.7: A 2.05,0; C -2.05,0
SOT23 = smd 1 x 1.4: 1 -0.95,-1.1; 2 0.95,-1.1; 3 0,1.1
16PINS_10X10_FULL = drill 1.475: 1 -3.81,3.81; 2 -1.27,3.81; 3 1.27,3.81; 4 3.81,3.81; 5 3.81,1.27; 6 1.27,1.27; 7 -1.27,1.27; 8 -3.81,1.27; 9 -3.81,-1.27; 10 -1.27,-1.27; 11 1.27,-1.27; 12 3.81,-1.27; 13 3.81,-3.81; 14 1.27,-3.81; 15 -1.27,-3.81; 16 -3.81,-3.81
1206L = smd 1 x 1.8: 1 -1.4,0; 2 1.4,0
HO15-NP/SP33-1000 = drill 0.9: GND -9.83,-2.54; GND2 -11.735,3.81; OCD -11.735,1.27; STANDBY -9.83,2.54; V-OUT -11.735,-1.27; V-REF -9.83,0 | drill 1.5: IN_1 6.2,4.9; IN_2 3.1,4.9; IN_3 0,4.9; OUT_1 6.2,-4.9; OUT_2 3.1,-4.9; OUT_3 0,-4.9 | drill 0.9 square: VCC -11.735,-3.81
SOIC127P600X175-14N = smd 1.981 x 0.559: 1 -2.362,3.81; 2 -2.362,2.54; 3 -2.362,1.27; 4 -2.362,0; 5 -2.362,-1.27; 6 -2.362,-2.54; 7 -2.362,-3.81; 8 2.362,-3.81; 9 2.362,-2.54; 10 2.362,-1.27; 11 2.362,0; 12 2.362,1.27; 13 2.362,2.54; 14 2.362,3.81
QFP80P900X900X120-32N = smd 1.6 x 0.55: 1 -4.18,2.8; 2 -4.18,2; 3 -4.18,1.2; 4 -4.18,0.4; 5 -4.18,-0.4; 6 -4.18,-1.2; 7 -4.18,-2; 8 -4.18,-2.8; 17 4.18,-2.8; 18 4.18,-2; 19 4.18,-1.2; 20 4.18,-0.4; 21 4.18,0.4; 22 4.18,1.2; 23 4.18,2; 24 4.18,2.8 | smd 0.55 x 1.6: 9 -2.8,-4.18; 10 -2,-4.18; 11 -1.2,-4.18; 12 -0.4,-4.18; 13 0.4,-4.18; 14 1.2,-4.18; 15 2,-4.18; 16 2.8,-4.18; 25 2.8,4.18; 26 2,4.18; 27 1.2,4.18; 28 0.4,4.18; 29 -0.4,4.18; 30 -1.2,4.18; 31 -2,4.18; 32 -2.8,4.18
SOIC127P600X175-8N = smd 1.981 x 0.533: 1 -2.464,1.905; 2 -2.464,0.635; 3 -2.464,-0.635; 4 -2.464,-1.905; 5 2.464,-1.905; 6 2.464,-0.635; 7 2.464,0.635; 8 2.464,1.905
SOIC127P600X175-8N' = smd 2.2 x 0.6: 1 -2.6,1.905; 2 -2.6,0.635; 3 -2.6,-0.635; 4 -2.6,-1.905; 5 2.6,-1.905; 6 2.6,-0.635; 7 2.6,0.635; 8 2.6,1.905
555153-1 = drill 0.889: 1 -4.445,6.35; 2 -3.175,8.89; 3 -1.905,6.35; 4 -0.635,8.89; 5 0.635,6.35; 6 1.905,8.89; 7 3.175,6.35; 8 4.445,8.89 | drill 1.575 pad 2.184: G1 -7.874,-3.048; G2 7.874,-3.048 | hole 3.251: -5.715,0; 5.715,0
HEAD3X2 = drill 0.914 pad 1.778 square: 1 0,0 | drill 0.914 pad 1.778: 2 0,2.54; 3 2.54,0; 4 2.54,2.54; 5 5.08,0; 6 5.08,2.54
MA05-2 = drill 1.016 octagon: 1 -5.08,-1.27; 2 -5.08,1.27; 3 -2.54,-1.27; 4 -2.54,1.27; 5 0,-1.27; 6 0,1.27; 7 2.54,-1.27; 8 2.54,1.27; 9 5.08,-1.27; 10 5.08,1.27
JST-PH6 = drill 0.813 pad 1.676 octagon: 1 5,0; 2 3,0; 3 1,0; 4 -1,0; 5 -3,0; 6 -5,0
0805 = smd 1.2 x 1: 1 -1.2,0; 2 1.2,0
1206 = smd 1.35 x 1.2: 1 -1.675,0; 2 1.675,0
CHIPLED_0805 = smd 1.2 x 1.2: A 0,-1.05; C 0,1.05
R0603 = smd 1 x 1.1: 1 -0.85,0; 2 0.85,0
R0805 = smd 1.3 x 1.5: 1 -0.95,0; 2 0.95,0
78XXS = drill 1.016 long: GND 0,-2.54; IN -2.54,-2.54; OUT 2.54,-2.54
SJ = smd 1.168 x 1.6: 1 -0.762,0; 2 0.762,0
SJ_2 = smd 1.168 x 1.6: 1 -1.524,0; 2 0,0; 3 1.524,0
3,2 = hole 3.2: 0,0
JST-XH-05-PACKAGE-LONG-PAD = drill 1.016 long: 1 -5.08,0; 2 -2.54,0; 3 0,0; 4 2.54,0; 5 5.08,0
RESONATOR = smd 0.7 x 2: 1 -1,0; 2 0,0; 3 1,0

### Placement (x,y rotation side)
C1  29.21,72.39 270 top
C2  24.13,72.39 270 top
C3  26.67,72.39 270 top
C4  80.01,72.39 270 top
C5  74.93,72.39 270 top
C6  77.47,72.39 270 top
C7  69.22,27.94 90 top
C8  74.3,27.94 90 top
C9  71.75,27.94 270 top
C10  19.05,27.94 90 top
C11  24.13,27.94 90 top
C12  21.59,27.94 270 top
C13  44.22,46.79 180 top
C14  19.37,39.05 270 top
C15  29.44,61.44 180 top
C16  59.05,34.29 180 top
C17  61.28,48.94 270 top
C18  25.4,63.5 270 top
C19  58.92,47.89 90 top
C20  13.31,73.19 270 top
C21  80.77,52.32 0 top
C22  33.02,73.98 270 top
C23  83.82,73.98 270 top
C24  65.02,26.35 90 top
C25  15.11,26.35 90 top
C26  68.33,47.75 0 top
C27  82.55,49.78 180 top
C28  77.47,42.67 0 top
C29  73.41,42.67 180 top
C30  82.3,55.63 0 top
C31  39.14,47.12 0 top
C32  36.32,51.82 180 top
C33  44.2,49.02 180 top
C34  88.01,43.81 180 top
C35  86.49,40.77 180 top
C36  90.55,32.64 0 top
C37  95.76,37.47 0 top
C41  34.52,61.44 0 top
D1  22.98,56.62 270 top
D2  19.81,62.8 270 top
D6  20.6,47.65 270 top
E1  8.89,91.44 0 top
E2  58.42,91.44 0 top
E4  90.17,8.89 0 top
E5  40.64,8.89 0 top
E6  40.64,91.44 0 top
E7  90.17,91.44 0 top
E8  58.42,8.89 0 top
E9  8.89,8.89 0 top
F1  22.88,63.32 270 top
IC1  24.13,87.63 90 top
IC2  74.93,87.63 90 top
IC3  74.3,12.7 270 top
IC4  24.13,12.7 270 top
IC5  74.93,49.53 180 top
IC6  51.62,48.27 180 top
IC7  23.18,39.05 90 top
IC8  MCP1501-40E/SN  [SOIC127P600X175-8N']  94.74,43.81 0 top
J1  8.1,41 270 top
J2  8.1,59.5 270 top
J6  40.23,57.16 270 top
J7  50.25,62.56 0 top
J8  86.74,31.62 90 top
L1  37.34,74.17 90 top
L2  87.55,74.14 90 top
L3  60.83,26.45 270 top
L4  11.86,26.19 270 top
L5  19.68,56.52 270 top
LED2  31.03,57.31 90 top
LED3  29.78,39.24 90 top
LED4  29.78,43.56 90 top
LED6  29.78,35.24 270 top
R1  21.59,72.39 270 top
R2  72.39,72.39 270 top
R3  76.83,27.94 90 top
R4  26.67,27.94 90 top
R5  63.37,34.29 0 top
R6  67.69,34.29 180 top
R7  33.66,39.24 0 top
R8  35.16,57.31 0 top
R9  33.91,43.56 0 top
R10  52.75,66.98 270 top
R11  36.32,54.1 0 top
R12  47.75,67.06 270 top
R13  47.75,57.91 90 top
R14  33.66,35.24 0 top
R15  68.33,50.04 180 top
R16  82.55,47.5 0 top
R17  77.47,40.13 0 top
R18  73.41,40.13 180 top
R19  57.82,66.98 270 top
R20  55.24,66.98 270 top
R21  90.55,28.57 180 top
R22  95.5,34.8 0 top
R31  23.97,50.49 180 top
REG1  31.98,67.79 0 top
SJ1  27.02,47.47 90 top
SJ2  73.91,56.64 180 top
SJ3  43.69,42.93 0 top
U$2  [3,2]  50,24 0 top
U$3  [3,2]  5,76 0 top
U$4  [3,2]  95,76 0 top
U$5  [3,2]  95,24 0 top
U$6  [3,2]  5,24 0 top
U$7  [3,2]  50,76 0 top
X2  62.48,39.88 180 top
Y1  58.74,51.59 90 top

### Tracks (layer width: path | path; a pad name or v marks a point on that pad's centre or on a via)
1_IN
  pour Bottom (no thermals): 26.67,13.92 26.67,1.27 46.35,1.27 46.35,13.92
  pour Top (no thermals): 26.67,13.92 46.35,13.92 46.35,1.27 26.67,1.27
1_OUT
  pour Top (no thermals): 21.27,1.27 21.27,13.92 2.22,13.92 2.22,1.27
  pour Bottom (no thermals): 2.22,13.92 21.27,13.92 21.27,1.27 2.22,1.27
1GNDA  (via drill 0.6)
  Top 0.406: C29.2 72.57,42.68 71.39,42.68 71.37,42.67 | IC5.14 71.88,45.72 71.37,45.21 71.37,42.67 | 71.37,42.67 71.37,34.29 70.23,33.02 21.21,33.02 20.19,32 v20.19,30.99
  other vias: 11.68,30.99 17.27,30.99 14.22,30.99 29.97,26.67 29.97,24.13 29.97,21.84 17.27,26.42 17.27,28.96 13.21,26.42 11.68,23.37 11.68,21.84 15.24,21.84 18.54,21.84 22.86,26.16 11.68,28.96 29.72,30.86 25.15,30.86 22.99,30.86
  pour Bottom: 11.18,21.34 30.48,21.34 30.48,31.5 11.18,31.5
  pour Top: 11.18,31.5 30.48,31.5 30.48,21.34 11.18,21.34
2_IN
  pour Bottom (no thermals): 72.39,99.06 52.39,99.06 52.39,86.47 72.39,86.47
  pour Top (no thermals): 52.39,99.06 72.39,99.06 72.39,86.47 52.39,86.47
2_OUT
  pour Top (no thermals): 77.79,99.06 95.89,99.06 95.89,86.41 77.79,86.41
  pour Bottom (no thermals): 77.79,99.06 95.89,99.06 95.89,86.41 77.79,86.41
2GND  (via drill 0.6)
  Top 0.406: IC5.4 80.94,49.53 C27.2 81.7,50.46 82.3,51.05 86.87,51.05 87.38,51.56 87.38,63.75 86.36,64.77 80.01,64.77 77.98,66.8 77.98,70.1 77.72,70.36 77.47,70.36 C6.2
  other vias: 87.38,78.74 69.34,78.49 69.09,75.95 69.09,71.37 76.2,72.39 73.66,72.39 73.66,74.17 76.2,74.17 81.53,74.17 81.53,72.39 81.53,70.61 84.58,70.61 87.63,70.61 83.57,78.74 80.26,78.74 69.09,73.66
  pour Top: 68.58,79.25 88.14,79.25 88.14,70.1 68.58,70.1
  pour Bottom: 68.58,79.25 88.14,79.25 88.14,70.1 68.58,69.85
3_IN
  pour Bottom (no thermals): 21.59,99.06 2.86,99.06 2.86,86.47 21.59,86.47
  pour Top (no thermals): 2.86,99.06 21.59,99.06 21.59,86.47 2.86,86.47
3_OUT
  pour Top (no thermals): 26.99,99.06 46.67,99.06 46.67,86.47 26.99,86.47
  pour Bottom (no thermals): 26.99,99.06 46.67,99.06 46.67,86.47 26.99,86.47
3GND  (via drill 0.6)
  Top 0.406: IC5.12 69.68,48.26 C26.2 69.18,47.08 68.58,46.48 66.55,46.48 66.29,46.74 66.29,51.31 66.55,51.56 66.55,60.45 65.91,61.09 61.59,61.09 60.71,61.98 60.71,68.45 59.94,69.22 27.69,69.22 26.92,69.98 26.92,70.1 26.67,70.36 C3.2
  Top 1.016: 33.51,72.97 C22.-
  other vias: 18.29,78.74 35.81,73.91 30.99,73.91 35.81,71.37 36.58,78.74 34.04,78.74 31.24,78.74 28.7,78.74 18.29,76.2 18.29,73.66 18.29,70.87 22.86,72.39 25.4,72.39 30.99,72.39 35.81,76.2
  pour Top: 17.78,79.25 17.78,70.1 37.85,70.1 37.85,79.25
  pour Bottom: 17.78,79.25 37.85,79.25 37.85,70.36 17.78,70.36
4_IN
  pour Bottom (no thermals): 76.52,1.27 96.2,1.27 96.2,13.92 76.52,13.92
  pour Top (no thermals): 76.52,13.92 96.2,13.92 96.2,1.27 76.52,1.27
4_OUT
  pour Top (no thermals): 72.07,1.27 72.07,13.92 51.75,13.92 51.75,1.27
  pour Bottom (no thermals): 51.75,13.92 72.07,13.92 72.07,1.27 51.75,1.27
4GNDA  (via drill 0.6)
  Top 0.406: 79.5,42.67 79.5,46.74 79.25,46.99 IC5.2 | 79.5,42.67 79.5,33.02 78.49,32 74.42,32 73.91,31.5 73.91,30.23 | C28.2 79.5,42.67
  other vias: 62.48,26.67 68.33,21.84 64.77,21.84 60.71,21.97 80.01,21.84 80.01,29.97 80.01,27.43 80.01,24.64 75.56,27.94 73.03,27.94 62.48,25.02 60.71,23.5 90.17,30.61 91.57,35.05 90.04,38.1 99.06,28.96 95.25,28.96 99.06,33.78 99.06,38.99 94.74,45.59 98.81,50.29 92.96,50.29 84.45,35.94 83.44,37.59 94.11,41.02 92.71,38.1 95.76,50.29 90.17,35.05 88.77,35.05 88.77,30.61 91.57,30.61 90.17,25.91 90.04,21.84 84.96,21.84 83.44,33.4 84.45,31.75 83.44,29.97 83.44,27.43 88.39,27.56 90.04,41.15 99.06,47.37 85.6,43.56 84.33,43.56
  pour Top: 60.2,30.48 82.93,30.48 82.93,44.2 89.53,44.2 89.53,50.8 99.31,50.8 99.69,50.67 99.69,28.45 90.68,28.45 90.68,21.21 82.93,21.21 60.2,21.34
  pour Bottom: 60.2,30.48 82.93,30.48 82.93,44.2 89.53,44.2 89.53,50.8 99.82,50.8 99.82,50.67 99.69,50.67 99.69,28.45 90.68,28.45 90.68,21.21 60.2,21.34
12V
  Top 0.305: J1.6 16.99,39.51 15.75,40.75 15.75,41.6 J1.3
  Top 1.27: J2.6 19.09,57.59 L5.1
  Bottom 0.406: J2.6 16.91,57.59 15.75,58.75 15.75,60.5 15,61.25 14.61,61.25 J2.3
  Bottom 1.016: J1.3 13.35,42.91 12.5,43.75 12.5,60.51 13.46,61.47 14.39,61.47 J2.3 14.36,61.5
+3V3  (via drill 0.6)  (1 unrouted)
  Top 0.305: C31.1 38.11,47.12 36.45,45.47 36.45,43.56 v36.32,43.43 | R21.1 91.82,28.57 92.71,29.46 92.71,35.69 91.82,36.58 86.79,36.58 J8.1 | IC8.3 91.31,43.18 | R4.2 v26.67,30.35
  Top 0.406: R8.2 36.1,59 | 36.1,59 36.1,61.26 C41.2 | R2.2 v72.39,69.53 | 28.26,76.21 IC1.VCC | 36.16,59.05 36.1,59 | R11.1 v33.02,54.1 | R19.1 R20.1 R10.1 47.83,67.83 | 47.83,67.83 45.73,67.83 45.17,67.27 J7.2 | R1.2 v21.59,70.1 | R3.2 76.71,28.92 v76.71,29.97 | R9.2 34.99,43.43 v36.32,43.43 | R7.2 34.73,39.12 v36.07,39.12 | R12.1 47.83,67.83 | R13.1 v47.75,56.13 | C33.1 46.3,50.27 IC6.18 48.5,50.27 48.51,50.29 48.77,50.29 | 60.07,34.46 C16.1 | R5.2 64.26,34.33 v64.26,35.56 66.42,35.56 66.84,35.14 R6.2 | 26.67,28.77 R4.2
  Top 0.559: 20.64,40.01 19.37,40.01 v19.05,41.27 | IC6.4 57.28,47.88 57.4,47.75
  Top 0.61: IC5.6 79.25,52.07 C21.1 | IC8.1 90.17,45.72 | 91.31,43.18 89.79,43.18 89.41,43.56
  Top 0.635: IC7.8 21.27,40.64 20.64,40.01 19.47,40.01 C14.1
  Top 0.813: 48.77,50.29 49.02,50.29 49.28,50.04 49.28,48.01 v49.53,47.75
  Top 1.016: C4.1 80.01,75.16 80.33,75.48 | C23.+ 79.69,75.48 | J7.2 43.75,65.25 REG1.OUT | 79.76,52.83 79.92,52.67 C21.1 | 57.4,47.75 v57.53,47.62 58.17,46.99 58.87,46.99 C19.1 61.42,47.04 61.47,46.99 | 60.07,34.46 v60.07,35.56 60.07,39.75 X2.4 | J8.1 86.74,38.35 88.52,40.13 88.52,40.23 | v89.03,66.17 90.42,66.17 91.31,65.28 91.31,49.53 90.17,48.39 90.17,45.72 90.17,44.32 89.41,43.56 88.77,42.93 | 88.52,40.23 88.52,42.16 88.65,42.42 88.77,42.93 | 88.77,42.93 88.77,43.73 C34.1 | 88.52,40.23 C35.+
  Top 1.27: 80.33,75.48 79.69,75.48 79.16,75.48 IC2.VCC | C22.+ 29.21,75.48 | 29.21,75.48 28.36,75.48 IC1.VCC | C1.1 29.21,75.48 | C25.+ 19.05,24.85 | 19.05,24.85 19.9,24.85 IC4.VCC | C10.1 19.05,24.85 | C24.+ 69.09,24.85 | 69.09,24.85 70.07,24.85 IC3.VCC | C7.1 69.22,24.98 69.09,24.85 | 79.76,52.83 79.76,54.59 C30.+ 77.98,55.63 76.45,57.15 v76.45,66.29 | X2.4 59.94,42.16 v61.47,43.69 v61.47,45.47 61.47,46.99 61.47,47.24 | 61.47,47.24 61.47,47.35 C17.2 61.28,47.43 61.47,47.24
  Top 1.5: C41.2 35.92,63.85 REG1.OUT
  Bottom 0.406: 33.27,51.82 33.02,52.07 | v33.02,54.1 33.27,54.1 33.02,53.85 | v21.59,70.1 27.43,70.1 28.83,71.5 | v76.71,29.97 69.09,29.97 68.2,29.08 68.2,28.77 | v36.32,43.43 33.02,43.43 | v36.07,39.12 33.27,39.12 33.02,39.37 | 44.2,58.93 42.77,57.5 J6.2 | v47.75,56.13 47.75,58.67 47.5,58.93 | v64.26,35.56 v60.07,35.56
  Bottom 0.559: v19.05,41.27 19.37,40.96 32.7,40.96 33.02,40.64
  Bottom 0.61: v26.67,30.35 26.67,28.77
  Bottom 0.813: v49.53,47.75 50.04,47.24 57.15,47.24 v57.53,47.62
  Bottom 1.016: 34.56,64.5 REG1.OUT | v90.3,66.17 v89.03,66.17 76.58,66.17 v76.45,66.29
  Bottom 1.27: v61.47,43.69 61.47,57.4 59.94,58.93 47.5,58.93 44.2,58.93 38.61,64.52 35.25,64.52 REG1.OUT | 76.45,64.01 v76.45,66.29 76.45,69.28 76.2,69.53
  Bottom 1.676: 20.45,27.56 20.45,24.56 IC4.VCC | 68.2,28.77 68.2,26.72 IC3.VCC
  Bottom 1.778: IC2.VCC 78.74,72.07 76.2,69.53 v72.39,69.53 34.52,69.53 | 34.52,69.53 30.8,69.53 28.83,71.5 27.94,72.39 IC1.VCC | 34.52,69.53 REG1.OUT 34.5,62.25 33.02,60.77 33.02,53.85 33.02,52.07 33.02,43.43 33.02,40.64 33.02,39.37 33.15,28.77 | 68.2,28.77 33.15,28.77 | 20.45,27.56 21.65,28.77 26.67,28.77 33.15,28.77
  other vias: 76.45,64.26
ATMEGA-AREF
  Top 0.406: IC6.20 46.39,48.67 45.97,48.26 45.97,47.75 45.47,47.24 45.47,47.19 C13.1
AUX_02
  Top 0.305: IC6.14 50.42,58.04 49.02,59.44 49.02,62.6 J7.6
AUX_03
  Top 0.305: IC6.13 51.22,58.26 50.29,59.18 50.29,61.25 J7.5
AUX_04
  Top 0.305: IC6.12 52.02,58.73 51.56,59.18 51.56,62.6 J7.8 52.79,66.09
  Top 0.406: 52.79,66.09 R10.2
AUX_05
  Top 0.305: IC6.11 52.82,61.26 J7.7
AUX_06
  Top 0.305: IC6.10 53.62,58.7 54.1,59.18 54.1,62.6 J7.10 55.33,66.05
  Top 0.406: 55.33,66.05 R20.2
AUX_07
  Top 0.305: IC6.9 54.42,58.23 55.33,59.14 J7.9 57.82,63.78 R19.2
CH1-OUTA
  Top 0.406: R18.1 C29.1 74.17,42.76 74.17,46.74 73.91,46.99 IC5.13
CH2-OUT
  Top 0.406: IC5.3 80.94,48.26 R16.1 81.7,47.92 83.06,49.28 83.06,49.44 C27.1
CH3-OUT
  Top 0.406: IC5.11 69.09,49.53 | 69.09,49.53 67.82,48.26 67.82,48.09 C26.1 | R15.1 69.18,49.62 69.09,49.53
CH4-OUTA
  Top 0.406: R17.1 C28.1 76.62,45.63 76.71,45.72 IC5.1
D11/MOSI
  Top 0.305: IC6.15 49.62,53.38 49.15,53.85 45.21,53.85 44.58,54.48 42.91,54.48 J6.4
D12/MISO  (via drill 0.6)
  Top 0.305: IC6.16 46.35,52.45 v46.23,52.58
  Bottom 0.305: v46.23,52.58 46.23,54.1 44.45,55.88 41.51,55.88 J6.1
D13/SCK
  Top 0.305: J6.3 40.63,54.62 41.91,53.34 43.94,53.34 46.23,51.05 47.42,51.05
  Top 0.406: 47.42,51.05 IC6.17
GND  (via drill 0.6)  (1 unrouted)
  Top 0.305: IC6.5 58.85,48.67 C19.2
  Top 0.813: C19.2 58.89,48.77
  Top 1.016: 57.57,25.18 57.53,25.15 57.53,27.24 | 57.53,27.24 v55.63,26.86 | L1.1 40.2,72.97 40.26,73.03 | L2.1 89.88,72.94 89.92,72.9 | L3.1 57.94,27.65 57.53,27.24 | L4.1 9.31,27.39 9.27,27.43
  other vias: 19.24,36.7 28,49.85 55.63,21.02 41.72,26.73 36.39,26.86 32.45,26.73 31.18,46.67 34.92,48.9 34.92,47.31 31.11,48.26 31.11,49.85 31.2,59.17 36.2,48.9 36.2,47.31 66.29,71.44 61.85,71.44 50.42,71.31 66.42,79.44 44.64,71.56 39.81,71.56 39.62,75.82 39.62,79.5 99.06,78.93 99.06,72.2 98.93,66.61 40.32,21.59 36.51,21.59 45.72,26.8 33.34,21.59 15.19,78.74 11.75,78.74 9.53,78.74 1.59,71.44 23.25,48.48 23.25,46.85 24.76,46.85 24.76,48.48 18.88,45.01 25.26,43.84 29.43,49.81 26.9,43.86 31.2,45.15 28.06,52.05 18.03,50.42 16.53,50.42 15.28,50.42 14.03,50.42 10.44,44.12 28.09,57.42 25.33,58.56 26.09,54.67 20.68,52.13 11.75,76.74 15.25,76.74 11.75,73.74 15.25,73.74 30.2,67.78 31.7,67.78 30.7,63.28 21.01,62.69 1.59,64.42 1.59,57.42 1.59,50.17 1.34,42.92 1.34,36.67 1.34,29.67 55.75,52.64 59.82,56.83 59.94,53.91 57.78,44.89 59.44,44.89 57.78,43.5 55.5,40.7 55.5,39.05 54.23,45.78 53.09,45.78 50.93,45.78 49.4,45.78 74.3,34.48 76.83,34.61 76.83,36.39 74.3,36.39 74.42,50.61 74.55,48.45 79.25,50.74 86.36,52.64 86.23,56.71 86.23,61.66 69.09,61.66 72.01,61.66 74.8,61.53 65.02,56.32 65.02,59.5 58.93,60.52 38.23,62.04 38.35,60.39 38.23,58.48 42.93,63.31 38.73,67.25 40.64,67.25 69.09,67.5 78.36,61.66 78.23,64.33 78.36,58.74 81.92,67.88 85.98,67.88 89.79,70.55 89.66,78.68 72.52,67.5 46.86,39.31 43.81,39.31 40.89,39.31 47.37,43.37 41.66,46.93 19.3,34.35 40.89,35.24 43.81,35.24 46.86,35.24 51.44,35.12 56.64,36 56.64,34.35 58.29,36 66.29,67.5 63.75,67.37 62.1,79.57 58.17,79.57 54.1,79.44 44.7,79.31 54.61,30.67 50.29,30.67 45.97,30.67 41.66,30.67 36.58,30.67 58.42,30.67 57.53,26.86 58.29,24.07 58.17,21.15 89.79,72.2 89.66,75.88 98.93,61.91 98.93,56.96 98.93,52.39 80.84,34.29 80.84,38.99 80.58,46.1 87.44,46.1 89.22,52.7 89.22,56.77 89.22,61.47 82.23,61.47 69.98,34.48 69.98,36.77 69.98,45.15 66.8,45.15 70.61,52.26 70.48,50.86 68.83,51.75 75.44,49.47 75.44,44.39 75.44,45.91 75.44,47.43 75.44,51.63 80.39,50.74 82.3,53.78 52.58,50.48 55.75,56.83 62.99,55.05 62.99,57.85 62.99,52.26 62.99,48.96 62.99,45.53 62.99,43.62 19.9,42.72 18.63,42.72 21.6,49.24 21.73,46.32 27.41,38.02 38.33,37.89 26.26,38.02 36.93,37.89 35.92,40.56 67.31,36.89 65.53,36.89 35.01,59.3 53.09,35.12 80.84,36.96 80.84,32.51 24.94,60.91 26.21,60.91
  pour Top: 22.25,48.75 24.75,48.75 24.75,46.25 22.25,46.25
  pour Bottom: 22.25,48.75 24.75,48.75 24.75,46.25 22.25,46.25
  pour Top: 0.38,80.01 16.51,80.01 16.51,68.58 39.12,68.58 39.12,80.14 67.44,80.14 67.44,68.71 89.15,68.71 89.15,79.63 99.82,79.63 99.82,76.45 99.69,76.45 99.82,51.82 99.82,51.69 88.65,51.69 88.65,45.34 81.92,45.34 81.92,31.75 58.93,31.88 58.93,20.19 31.88,20.19 31.88,32.89 10.16,32.89 10.16,19.68 0.38,19.68
  pour Bottom: 0.38,80.01 16.51,80.01 16.51,68.2 39.12,68.2 39.12,80.14 67.44,80.14 67.44,68.71 89.15,68.71 89.15,79.63 99.82,79.63 99.82,72.64 99.95,72.64 99.82,51.82 99.82,51.69 88.65,51.69 88.65,45.34 81.92,45.34 81.92,31.75 58.93,31.75 58.93,20.19 31.75,20.19 31.75,32.89 10.16,32.89 10.16,19.68 0.38,19.68
I2C_INT
  Top 0.305: IC6.1 55.8,43.52 57.4,41.91 X2.5
I2C_SCL  (via drill 0.6)
  Top 0.406: IC5.8 v69.34,53.34 | v65.66,52.83 65.41,52.58 65.41,44.32 67.56,42.16 X2.1 68.54,38.9 R6.1 | IC6.28 51.22,42.26 v51.56,42.16
  Bottom 0.406: v69.34,53.34 66.17,53.34 v65.66,52.83 | v51.56,42.16 66.55,42.16 67.56,41.15 X2.1
I2C_SDA  (via drill 0.6)
  Top 0.406: IC5.7 77.29,53.52 v76.2,54.61 | v65.66,54.61 64.64,54.61 64.14,54.1 64.14,42.93 62.48,41.15 X2.3 62.52,39.84 R5.1 | IC6.27 50.42,40.51 v51.05,39.88
  Bottom 0.406: v76.2,54.61 v65.66,54.61 | v51.05,39.88 53.34,37.59 61.98,37.59 62.48,38.1 X2.3
N$1
  Top 0.305: IC6.23 46.27,46.27 45.97,45.97 45.97,45.47 45.21,44.7 42.67,44.7 42.16,44.2 SJ3.1
N$2
  Top 0.406: IC1.OCD 22.86,74.51 R1.1
N$3
  Top 0.305: IC6.24 47.44,45.15 SJ3.3
N$4
  Top 0.406: IC1.V-REF C2.1
N$5
  Top 0.305: J8.5 89.65,28.62 R21.2
N$6  (via drill 0.6)
  Top 0.305: R17.2 78.36,40.09 v78.36,35.69 78.36,33.78 77.72,33.15 73.66,33.15 71.75,31.24 C9.1 71.72,28.83 70.87,28.83 70.48,28.45 70.48,26.16 70.87,25.78 71.75,25.78 73.03,24.51 IC3.V-OUT | C36.1 86.76,32.64 J8.3
  Bottom 0.305: J8.3 86.12,32.62 83.06,35.69 v78.36,35.69
N$7
  Top 0.305: IC8.8 IC8.7 95.76,44.45 95.25,43.94 95.25,39.37 94.61,38.73 94.61,37.66 C37.1 94.11,37.47 93.6,36.96 93.6,28.83 91.95,27.18 89.66,27.18 89.03,26.54 89.03,25.4 88.27,24.64 85.72,24.64 84.96,25.4 84.96,30.1 85.49,30.62 J8.4
N$8
  Top 0.406: R2.1 72.39,74.62 IC2.OCD
N$9
  Top 0.406: IC2.V-REF C5.1
N$10
  Top 0.406: IC2.V-OUT 76.25,75.89 77.47,74.68 C6.1 78.4,73.24 78.74,72.9 78.74,67.31 80.52,65.53 86.87,65.53 88.14,64.26 88.14,48.01 87.63,47.5 R16.2
N$11
  Top 0.305: R22.1 94.65,35.98 94.87,36.2 96.39,36.2 96.65,36.45 96.65,37.4 C37.2
N$12
  Top 1.016: D1.A 22.56,54.84
  Top 1.27: L5.2 22.56,54.84 arc-90 D1.A
N$13
  Top 0.406: IC3.OCD 75.56,25.82 R3.1
N$14
  Top 0.406: IC3.V-REF C8.1
N$18
  Top 0.406: IC4.OCD 25.4,25.82 R4.1
N$19
  Top 0.406: C11.1 IC4.V-REF
N$23
  Top 0.406: IC6.8 55.9,51.08 57.4,52.58 58.73,52.58 Y1.3
N$25
  Top 0.406: R8.1 LED2.A
N$27
  Top 1.016: D1.C 22.88,58.92
  Top 1.27: 22.88,58.92 F1.2
N$34
  Top 0.406: LED3.A R7.1
N$35
  Top 0.406: LED4.A R9.1
N$36
  Top 0.406: LED6.C R14.1
N$38
  Top 0.406: IC5.9 74.17,52.07 74.68,52.58 SJ2.1
N$39
  Top 0.406: IC1.V-OUT 25.4,74.51 C3.1 26.76,73.15 27.69,73.15 27.94,72.9 27.94,70.48 28.45,69.98 60.45,69.98 61.63,68.8 61.63,62.95 62.36,62.1 66.42,62.1 67.56,60.96 R15.2
N$42
  Top 0.406: IC4.V-OUT 22.66,24.64 22.35,24.64 20.32,26.67 20.32,28.45 20.66,28.79 C12.1 | C12.1 21.59,28.7 | R18.2 72.56,33.95 70.74,32.13 22.61,32.13 21.59,31.11 C12.1
N$60
  Top 0.254: R31.1 26.34,50.49 27.05,49.78 27.05,48.26 SJ1.2
RESET  (via drill 0.6)
  Top 0.406: IC6.29 52.02,47.8 v51.05,48.77 | v44.2,50.55 41.4,50.55 40.23,51.72 J6.5 39.96,51.82 C32.1 R11.2
  Bottom 0.406: v51.05,48.77 49.53,50.29 44.45,50.29 v44.2,50.55
RS485_DE  (via drill 0.6)
  Top 0.406: IC7.2 IC7.3 23.81,35.24 24.13,34.92 28.41,34.92 LED6.A 28.96,35.02 28.96,34.04 29.21,33.78 49.28,33.78 49.53,34.04 v49.53,34.8 | IC6.26 49.62,39.2 v49.53,39.12
  Bottom 0.406: v49.53,39.12 v49.53,34.8
RS485_N  (via drill 0.6)  (2 unrouted)
  Top 0.254: 19.8,48.54 D6.1 19.56,48.66 19.56,48.88 v20.39,49.71 21.17,50.49 R31.2 | J2.2 16.8,62.62 12.67,62.62 12.31,62.26 | 19.33,48.54 18.53,47.87 17.14,47.87 | 17.14,47.87 12.8,47.87 12.31,48.36 12.31,62.23 | IC7.6 23.81,43.5 v23.5,43.81 | v17.02,48.51 17.02,47.99 17.14,47.87
  Bottom 0.254: J1.2 16.99,48.23 v17.02,48.51 | v23.5,43.81 20.83,43.81 20.19,44.45 20.19,49.52 v20.39,49.71
RS485_P  (1 unrouted)
  Top 0.254: J2.1 13.37,63.11 12.47,63.11 11.82,62.46 11.82,48.16 12.6,47.38 14.48,47.38 | 14.48,47.38 18.55,47.38 19.19,46.61 19.4,46.61 D6.2 | SJ1.1 26.02,46.71 24.64,45.33 22.48,45.33 | 22.48,45.33 20.7,45.33 19.6,46.78 | IC7.7 22.49,41.71 22.49,45.21 22.48,45.23 22.48,45.33 | J1.1 14.48,45.47 14.48,47.38
RS485_RX
  Top 0.406: IC7.1 21.27,38.04 22.35,39.12 25.91,39.12 28.45,41.66 28.96,41.66 | 28.96,41.66 36.32,41.66 40.13,37.85 51.56,37.85 52.83,39.12 52.83,44.08 IC6.30 | LED4.C 28.96,43.34 28.96,41.66
RS485_TX
  Top 0.406: 25.08,36.83 IC7.4 25.32,36.83 28.7,36.83 | 28.7,36.83 52.32,36.83 53.59,38.1 53.59,44.07 IC6.31 | LED3.C 28.73,36.86 28.7,36.83
SCL1  (via drill 0.6)
  Top 0.406: J7.3 47.75,61.25 R13.2 48.43,58.76 49.28,57.91 v49.28,57.15 | v53.85,49.53 55.74,49.53 IC6.6
  Bottom 0.406: v49.28,57.15 49.28,55.37 53.85,50.8 v53.85,49.53
SDA1  (via drill 0.6)
  Top 0.305: v48.26,54.86 46.61,54.86 45.97,55.5 45.97,59.69 46.48,60.2 46.48,62.6 J7.4
  Top 0.406: R12.2 47.71,66.16 J7.4 | IC6.3 54.52,47.08 v51.05,50.55
  Bottom 0.406: v51.05,50.55 48.26,53.09 v48.26,54.86
VBAT12V
  Top 1.016: 29.19,65 REG1.IN 28.9,65.79 28.32,65.79 | D2.C 20.07,65.11 20.07,66.67 | F1.1 22.99,64.83 22.99,66.67 | C18.1 25.4,66.17 25.27,66.17 25.27,66.67 25.65,66.67
  Top 1.5: C15.2 28.04,63.85 REG1.IN
  Top 3.81: C20.+ 13.8,69.64 16.38,66.67 20.07,66.67 22.99,66.67 25.65,66.67 27.69,66.67 28.32,65.79
XTAL2
  Top 0.406: Y1.1 57.7,50.59 57.4,50.29 55.81,50.29 IC6.7

### Text on the board
tNames: CH 3 IN | CH 3 OUT | CH 2 IN | CH 2 OUT | HO15-NP/SP33-1000 | 0X68 / 0X69 | i2c Adr | RTS 2020 | Current | Sense V1.2 | G | * | * | RX | * | TX | i2c | DE | SJ3 RS485 ID# / 64, 65, 66, 67 | CH 1 IN | CH 4 OUT | CH 4 IN | CH 1 OUT